# Altium project HW_PROCESSOR_BOARD_R1.PrjPcb (part 1 of 2)
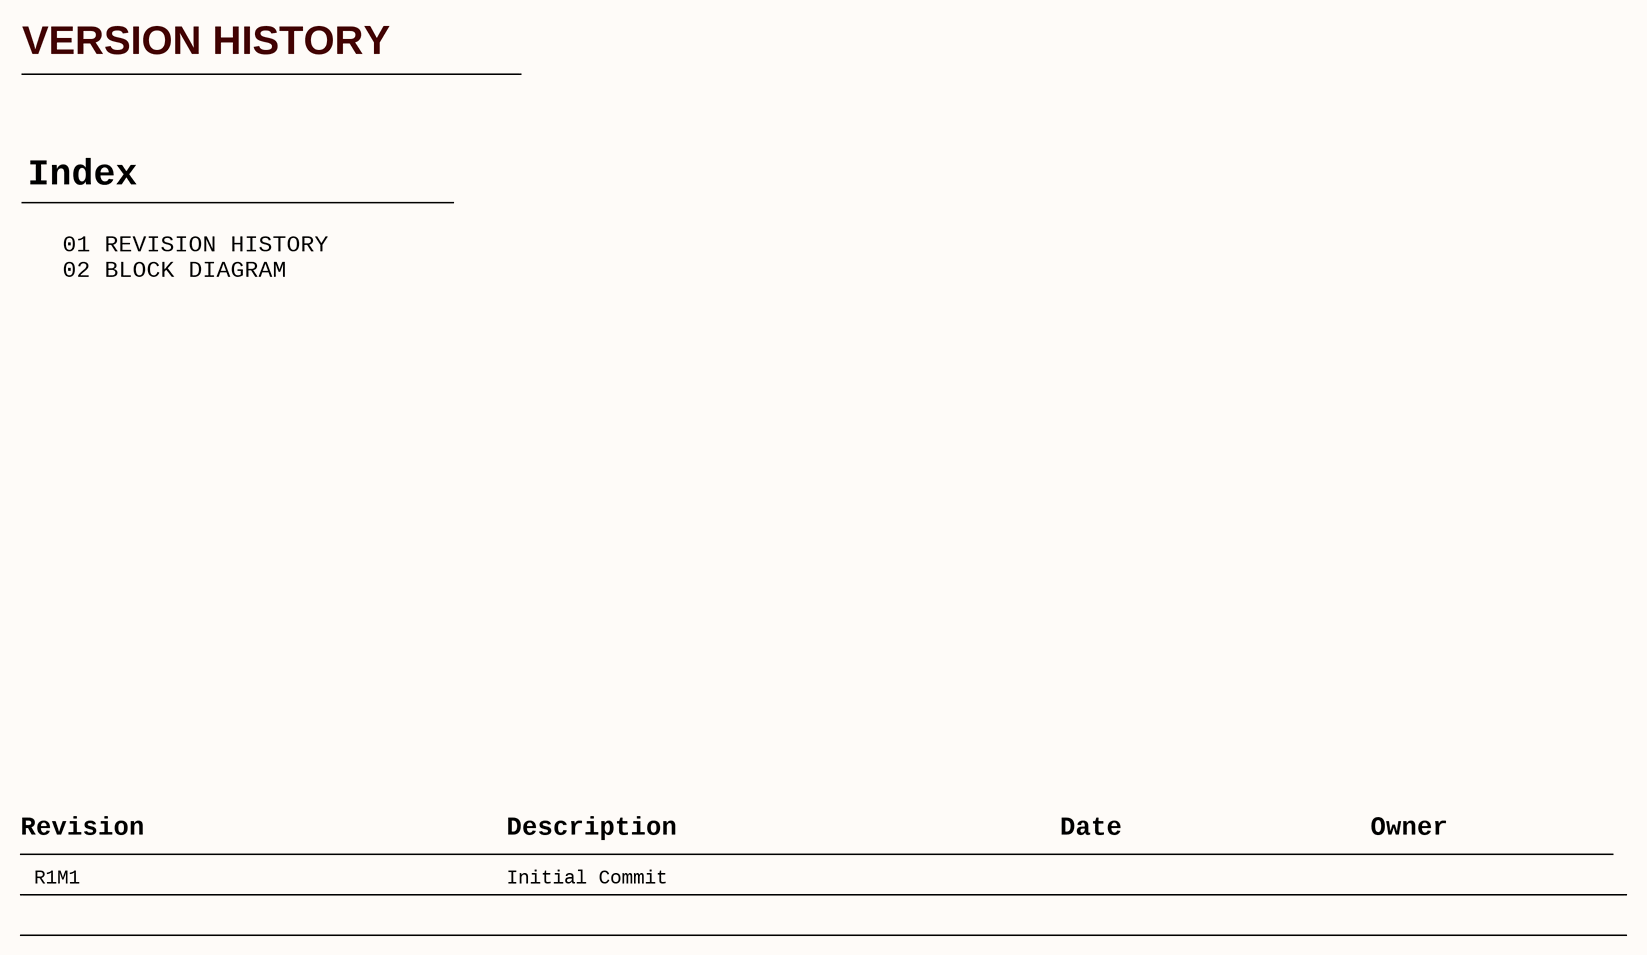
[diagram p0: 01_REVISION_HISTORY.SchDoc]
TitleParameter: HW_PROCESSOR_BOARD; RevisionParameter: R1M1; DrawnByParameter: UKAYACIK
5 sheets, 151 parts. Net scope: global (net labels, ports and power ports of the same name join across sheets).
Board file: HW_PROCESSOR_BOARD_R1.PcbDoc
Sheets:
  01_REVISION_HISTORY.SchDoc
  02_BLOCK_DIAGRAM.SchDoc
  03_CONNECTOR.SchDoc
  04_MCU.SchDoc
  05_BUFFERS.SchDoc

## Sheet 01_REVISION_HISTORY.SchDoc: =TitleParameter
size A3; DrawnBy: UKAYACIK; Organization: ASISGUARD; Address1: Kemalpasa, Kemalpasa Cd. No:290 D:292H, 35060 Bornova/Izmir/Turkey; Revision: R1M1

### Notes on the sheet
- VERSION HISTORY
- Index
- 01 REVISION HISTORY
  02 BLOCK DIAGRAM
- Revision
- R1M1
- Description
- Initial Commit
- Date
- Owner
- Proje/Project:
- Sayfa Adı/Document Name:
- Çizilme Tarihi/Drawing Date
- Umit KAYACIK
- Tasarlayan/Designed By
- Sayfa/Sheet:
- Revision:
- of
- Son Güncelleme/Last Edit Date
- Kontrol eden/Checked By
- Onaylayan/Approved By
- Boyut/Size:
- Varyant/Variant:
- Dil/Language:
- A3
- ENG

## Sheet 02_BLOCK_DIAGRAM.SchDoc: =TitleParameter
size A3; DrawnBy: UKAYACIK; Organization: ASISGUARD; Address1: Kemalpasa, Kemalpasa Cd. No:290 D:292H, 35060 Bornova/Izmir/Turkey; Revision: R1M1
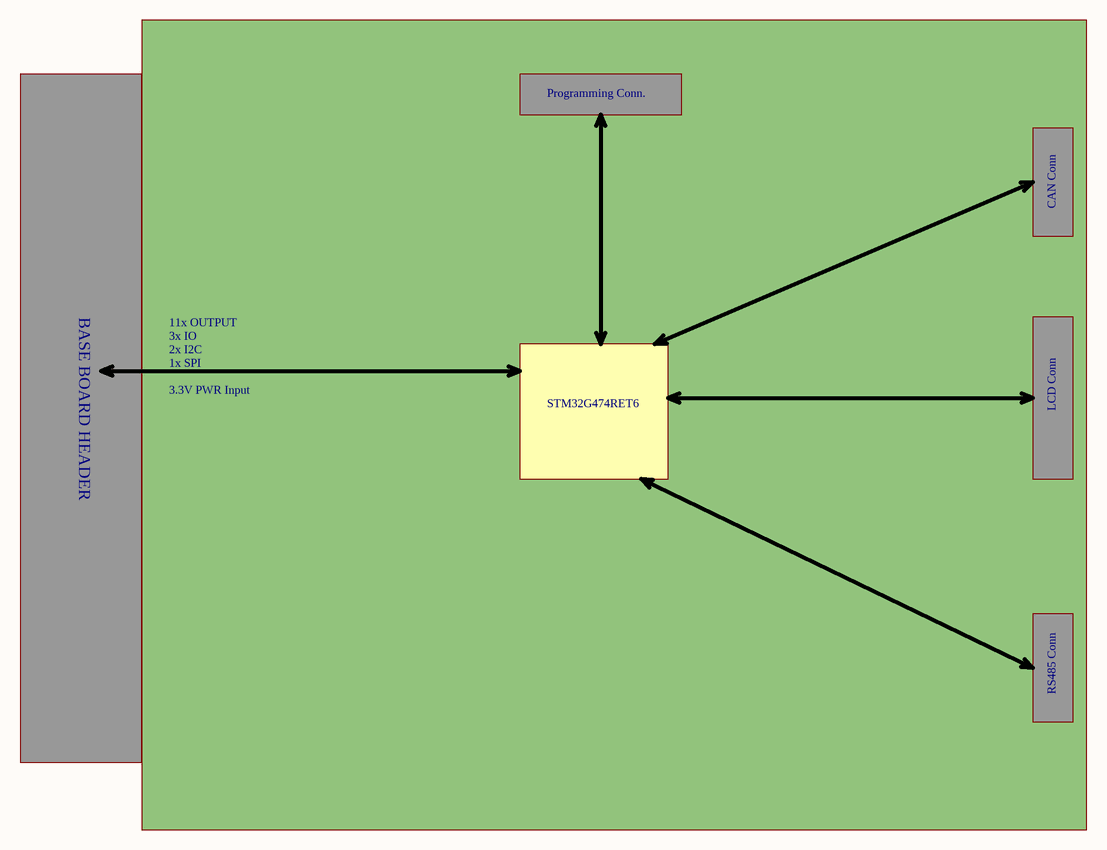
[diagram p1: 02_BLOCK_DIAGRAM.SchDoc]

### Notes on the sheet
- Programming Conn.
- CAN Conn
- BASE BOARD HEADER
- 11x OUTPUT
- 3x IO
- 2x I2C
- 1x SPI
- 3.3V PWR Input
- STM32G474RET6
- LCD Conn
- RS485 Conn
- Proje/Project:
- Sayfa Adı/Document Name:
- Çizilme Tarihi/Drawing Date
- Umit KAYACIK
- Tasarlayan/Designed By
- Sayfa/Sheet:
- Revision:
- of
- Son Güncelleme/Last Edit Date
- Kontrol eden/Checked By
- Onaylayan/Approved By
- Boyut/Size:
- Varyant/Variant:
- Dil/Language:
- A3
- ENG

## Sheet 03_CONNECTOR.SchDoc: =TitleParameter
size A2; SPICEModelCacheRTZHBNFU: <root> / <DocumentId>RTZHBNFU</DocumentId> / </root>; DrawnBy: UKAYACIK; Revision: R1M1
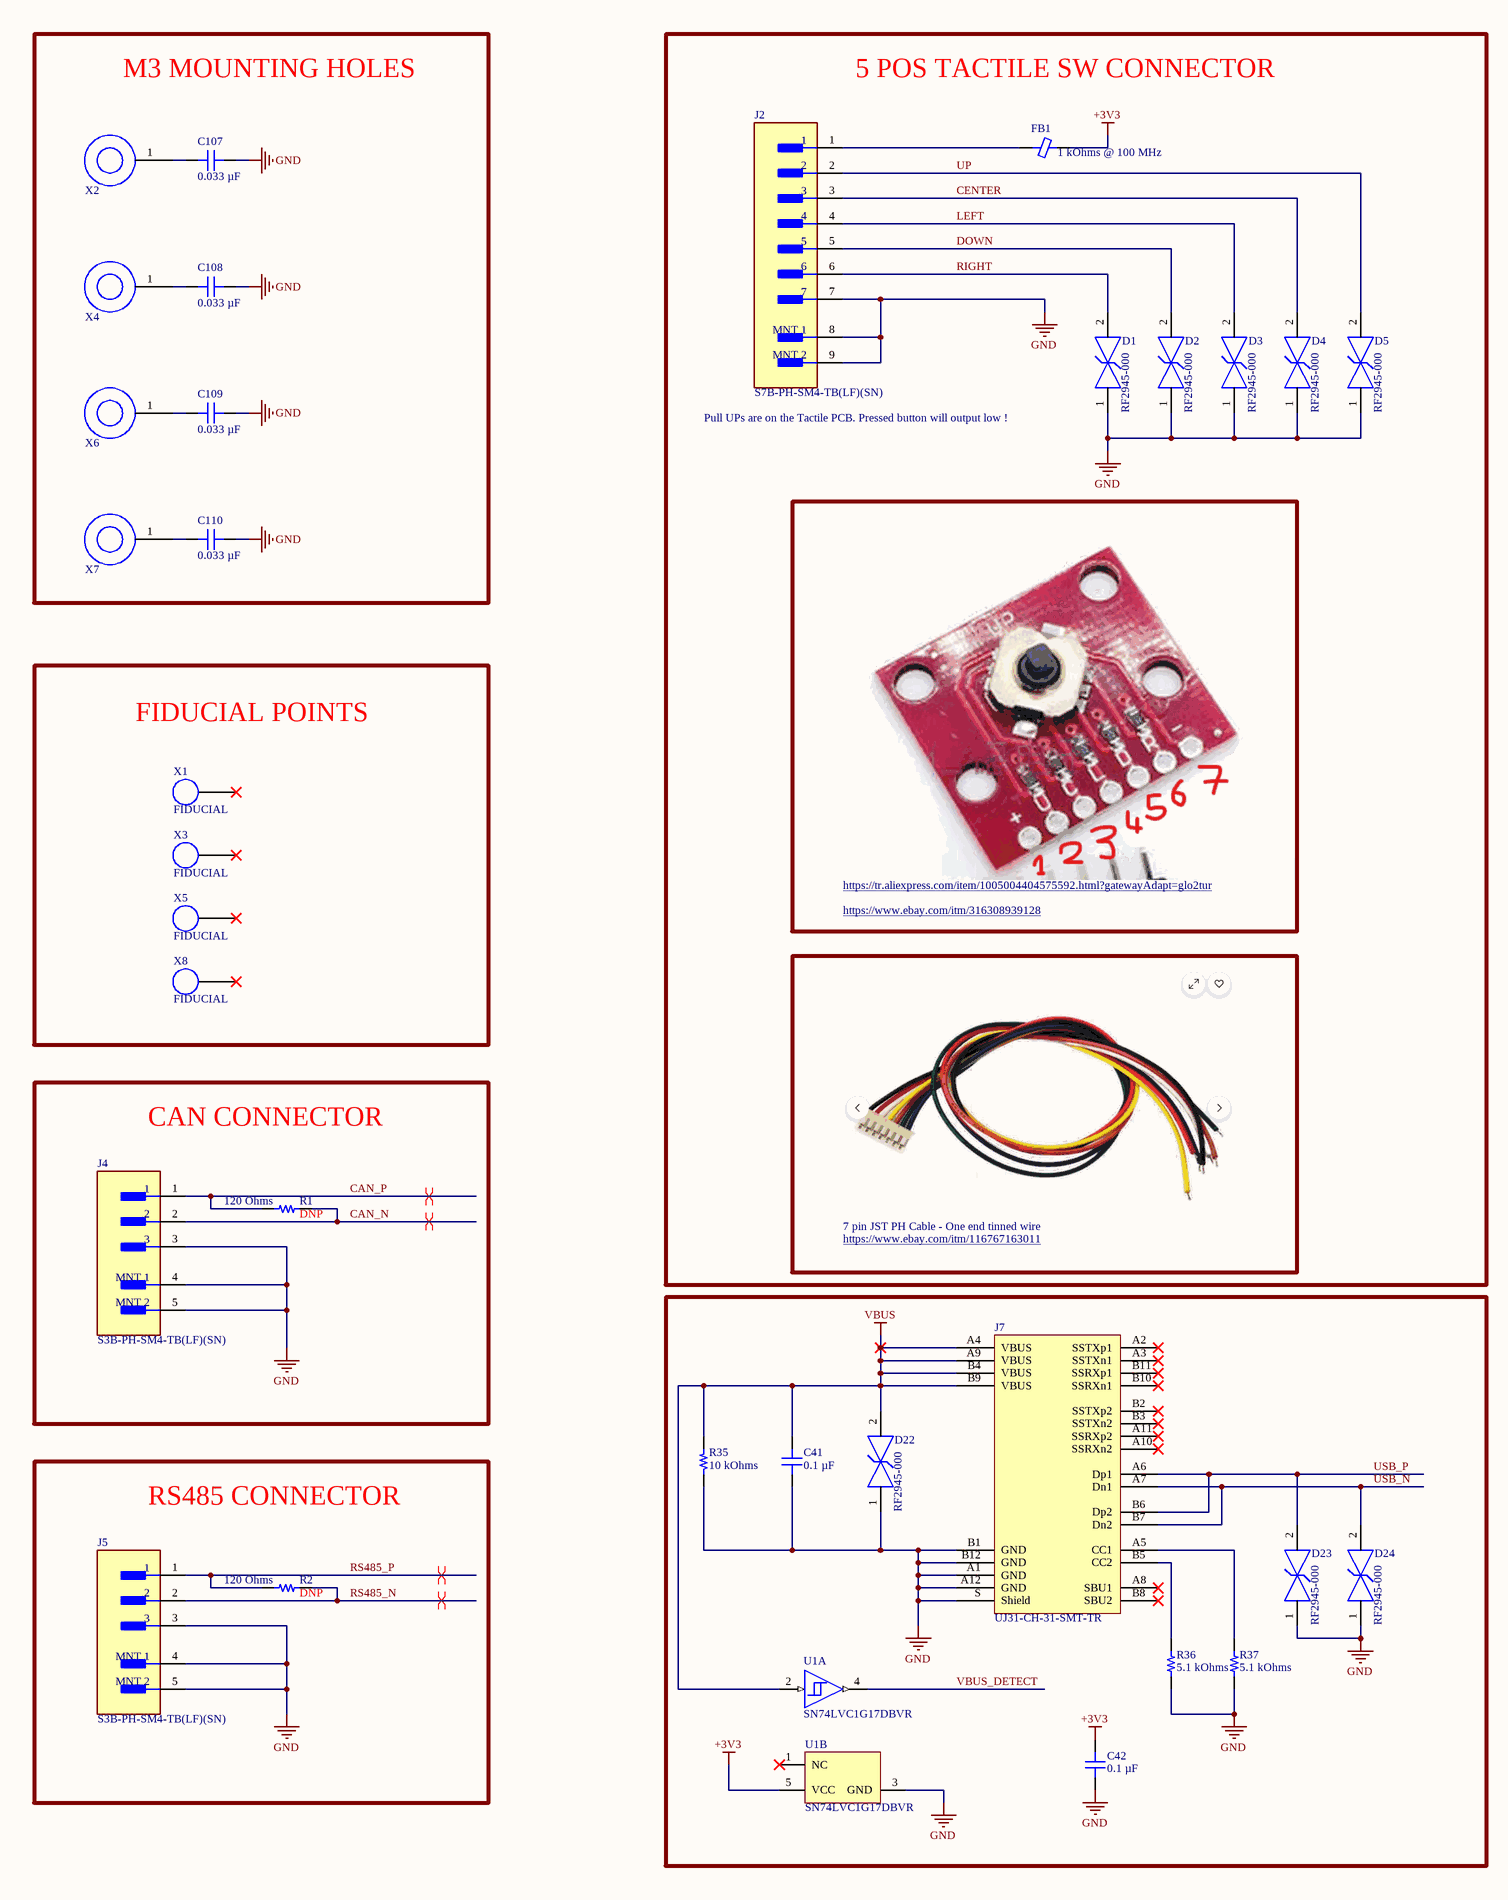
[diagram p2: 03_CONNECTOR.SchDoc, left]
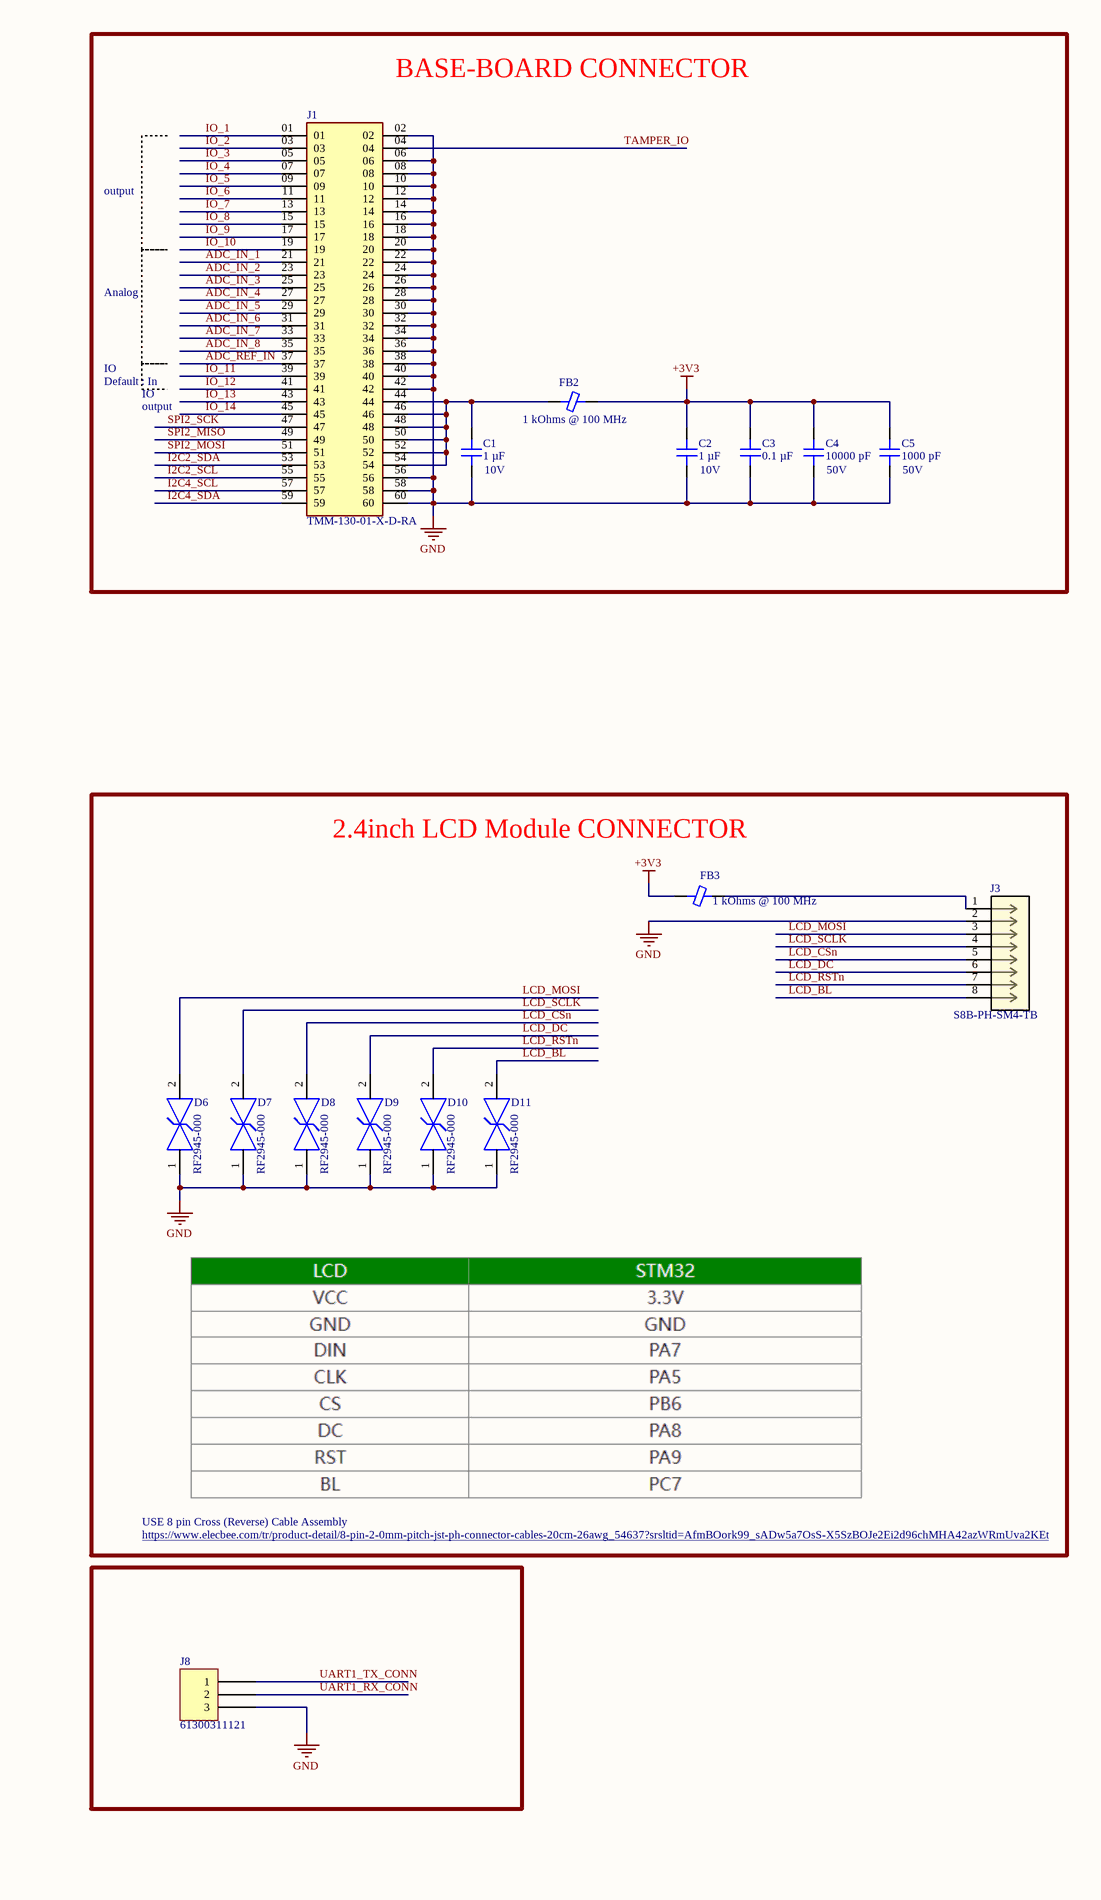
[diagram p3: 03_CONNECTOR.SchDoc, right]

### Parts
C1  Voltage - Rated: 10V  [CAP 0402_1005]  (hidden comment: 1 µF)
C2  Voltage - Rated: 10V  [CAP 0402_1005]  (hidden comment: 1 µF)
C3  0.1 µF  [MURATA GRM155 0402_1005]
C4  Voltage - Rated: 50V  [CAP 0402_1005]  (hidden comment: 10000 pF)
C5  Voltage - Rated: 50V  [CAP 0402_1005]  (hidden comment: 1000 pF)
C41  0.1 µF  [MURATA GRM155 0402_1005]
C42  0.1 µF  [MURATA GRM155 0402_1005]
C107  0.033 µF  [CAP 1210_3225 - 1MM]
C108  0.033 µF  [CAP 1210_3225 - 1MM]
C109  0.033 µF  [CAP 1210_3225 - 1MM]
C110  0.033 µF  [CAP 1210_3225 - 1MM]
D1  RF2945-000  [FP-SESD0402-MFG]
D2  RF2945-000  [FP-SESD0402-MFG]
D3  RF2945-000  [FP-SESD0402-MFG]
D4  RF2945-000  [FP-SESD0402-MFG]
D5  RF2945-000  [FP-SESD0402-MFG]
D6  RF2945-000  [FP-SESD0402-MFG]
D7  RF2945-000  [FP-SESD0402-MFG]
D8  RF2945-000  [FP-SESD0402-MFG]
D9  RF2945-000  [FP-SESD0402-MFG]
D10  RF2945-000  [FP-SESD0402-MFG]
D11  RF2945-000  [FP-SESD0402-MFG]
D22  RF2945-000  [FP-SESD0402-MFG]
D23  RF2945-000  [FP-SESD0402-MFG]
D24  RF2945-000  [FP-SESD0402-MFG]
FB1  1 kOhms @ 100 MHz  [FER 1206_3216]
FB2  1 kOhms @ 100 MHz  [FER 1206_3216]
FB3  1 kOhms @ 100 MHz  [FER 1206_3216]
J1  TMM-130-01-X-D-RA  [SAMTEC_TMM-130-01-X-D-RA]
J2  S7B-PH-SM4-TB(LF)(SN)  [FP-S7B-PH-SM4-TB_LF_SN-MFG]
J3  S8B-PH-SM4-TB  [CONN_S8B-PH-SM4-TB_JST]
J4  S3B-PH-SM4-TB(LF)(SN)  [FP-S3B-PH-SM4-TB_LF_SN-MFG]
J5  S3B-PH-SM4-TB(LF)(SN)  [FP-S3B-PH-SM4-TB_LF_SN-MFG]
J7  UJ31-CH-31-SMT-TR  [CUI UJ31-CH-31-SMT-TR]
J8  61300311121  [WURTH WE-PHD 61300311121]
R1  120 Ohms  [YAGEO RES 0805_2012]
R2  120 Ohms  [YAGEO RES 0805_2012]
R35  10 kOhms  [RES 0402_1005]
R36  5.1 kOhms  [YAGEO RES 0402_1005]
R37  5.1 kOhms  [YAGEO RES 0402_1005]
U1  SN74LVC1G17DBVR  [DBV0005A_L]  (parts A,B of 2)
X1  FIDUCIAL  [FIDUCIAL]  (no BOM)
X2  M3  [FIXING_M3]  (value not drawn)  (no BOM)
X3  FIDUCIAL  [FIDUCIAL]  (no BOM)
X4  M3  [FIXING_M3]  (value not drawn)  (no BOM)
X5  FIDUCIAL  [FIDUCIAL]  (no BOM)
X6  M3  [FIXING_M3]  (value not drawn)  (no BOM)
X7  M3  [FIXING_M3]  (value not drawn)  (no BOM)
X8  FIDUCIAL  [FIDUCIAL]  (no BOM)

### Blocks framed on the sheet
M3 MOUNTING HOLES: C107-C110 X2 X4 X6 X7
5 POS TACTILE SW CONNECTOR: D1-D5 FB1 J2
BASE-BOARD CONNECTOR: C1-C5 FB2 J1
FIDUCIAL POINTS: X1 X3 X5 X8
2.4inch LCD Module CONNECTOR: D6-D11 FB3 J3
CAN CONNECTOR: J4 R1
RS485 CONNECTOR: J5 R2

### Nets
+3V3: C2.2 C3.2 C4.2 C5.2 C42.2 FB1.2 FB2.2 FB3.1 U1.5(VCC)
GND: C1.1 C2.1 C3.1 C4.1 C5.1 C41.1 C42.1 C107.2 C108.2 C109.2 C110.2 D1.1 D2.1 D3.1 D4.1 D5.1 D6.1 D7.1 D8.1 D9.1 D10.1 D11.1 D22.1 D23.1 D24.1 J1.02 J1.06 J1.08 J1.10 J1.12 J1.14 J1.16 J1.18 J1.20 J1.22 J1.24 J1.26 J1.28 J1.30 J1.32 J1.34 J1.36 J1.38 J1.40 J1.42 J1.56 J1.58 J1.60 J2.7 J2.8(MNT_1) J2.9(MNT_2) J3.2 J4.3 J4.4(MNT_1) J4.5(MNT_2) J5.3 J5.4(MNT_1) J5.5(MNT_2) J7.A1(GND) J7.A12(GND) J7.B1(GND) J7.B12(GND) J7.S(Shield) J8.3 R35.2 R36.1 R37.1 U1.3(GND)
VBUS: C41.2 D22.2 J7.A4(VBUS) J7.A9(VBUS) J7.B4(VBUS) J7.B9(VBUS) R35.1 U1.2(A)
ADC_IN_1: J1.21
ADC_IN_2: J1.23
ADC_IN_3: J1.25
ADC_IN_4: J1.27
ADC_IN_5: J1.29
ADC_IN_6: J1.31
ADC_IN_7: J1.33
ADC_IN_8: J1.35
ADC_REF_IN: J1.37
CAN_N: J4.2 R1.2
CAN_P: J4.1 R1.1
CENTER: D4.2 J2.3
DOWN: D2.2 J2.5
I2C2_SCL: J1.55
I2C2_SDA: J1.53
I2C4_SCL: J1.57
I2C4_SDA: J1.59
IO_1: J1.01
IO_2: J1.03
IO_3: J1.05
IO_4: J1.07
IO_5: J1.09
IO_6: J1.11
IO_7: J1.13
IO_8: J1.15
IO_9: J1.17
IO_10: J1.19
IO_11: J1.39
IO_12: J1.41
IO_13: J1.43
IO_14: J1.45
LCD_BL: D11.2 J3.8
LCD_CSn: D8.2 J3.5
LCD_DC: D9.2 J3.6
LCD_MOSI: D6.2 J3.3
LCD_RSTn: D10.2 J3.7
LCD_SCLK: D7.2 J3.4
LEFT: D3.2 J2.4
RIGHT: D1.2 J2.6
RS485_N: J5.2 R2.2
RS485_P: J5.1 R2.1
SPI2_MISO: J1.49
SPI2_MOSI: J1.51
SPI2_SCK: J1.47
TAMPER_IO: J1.04
UART1_RX_CONN: J8.2
UART1_TX_CONN: J8.1
UP: D5.2 J2.2
USB_N: D24.2 J7.A7(Dn1) J7.B7(Dn2)
USB_P: D23.2 J7.A6(Dp1) J7.B6(Dp2)
VBUS_DETECT: U1.4(Y)
NetC1_2: C1.2 FB2.1 J1.44 J1.46 J1.48 J1.50 J1.52 J1.54
NetC107_1: C107.1 X2.1
NetC108_1: C108.1 X4.1
NetC109_1: C109.1 X6.1
NetC110_1: C110.1 X7.1
NetFB1_1: FB1.1 J2.1
NetFB3_2: FB3.2 J3.1
NetJ7_A5: J7.A5(CC1) R37.2
NetJ7_B5: J7.B5(CC2) R36.2

Not connected (* = marked no-connect by the designer): J7 A2(SSTXp1)* A3(SSTXn1)* A8(SBU1)* A10(SSRXn2)* A11(SSRXp2)* B2(SSTXp2)* B3(SSTXn2)* B8(SBU2)* B10(SSRXn1)* B11(SSRXp1)*; U1 1(NC)*; X1 1*; X3 1*; X5 1*; X8 1*

### Layout directives
differential pair: CAN_N, CAN_P, RS485_N, RS485_P

### Notes on the sheet
- output
- Analog
- IO
- Pull UPs are on the Tactile PCB. Pressed button will output low !
- Default : In
- https://tr.aliexpress.com/item/1005004404575592.html?gatewayAdapt=glo2tur
- https://www.ebay.com/itm/316308939128
- (near R1) DNP
- 7 pin JST PH Cable - One end tinned wire
- https://www.ebay.com/itm/116767163011
- USE 8 pin Cross (Reverse) Cable Assembly
- https://www.elecbee.com/tr/product-detail/8-pin-2-0mm-pitch-jst-ph-connector-cables-20cm-26awg_54637?srsltid=AfmBOork99_sADw5a7OsS-X5SzBOJe2Ei2d96chMHA42azWRmUva2KEt
- (near R2) DNP
- Proje/Project:
- Sayfa Adı/Document Name:
- Çizilme Tarihi/Drawing Date
- Son Güncelleme/Last Edit Date
- Umit KAYACIK
- Tasarlayan/Designed By
- Kontrol eden/Checked By
- Boyut/Size:
- Sayfa/Sheet:
- Revision:
- A3
- of
- Onaylayan/Approved By
- Varyant/Variant:
- Dil/Language:
- ENG

### Library data of the parts
C1 C2 = C1005X7S1A105K050BC: CAP CER 1UF 10V X7S 0402; manufacturer: TDK Corporation; Tolerance: ±10%; Part Number: C1005X7S1A105K050BC; Value: 1 µF; Applications: General Purpose; Capacitance: 1 µF; componentlink1description: Datasheet; componentlink1url: https://product.tdk.com/info/en/catalog/datasheets/mlcc_commercial_general_en.pdf?ref_disty=digikey; componentlink2description: DigiKey Link; componentlink2url: https://www.digikey.com/en/products/detail/tdk-corporation/C1005X7S1A105K050BC/3661576; Device Package: 0402 (1005 Metric); Features: Low ESL; lastupdated: 2/9/2024 8:04:17 PM; Lifecycle Status: Active; Minimum Order: 1; Mounting Type: Surface Mount, MLCC; Operating Temperature: -55°C ~ 125°C; Package / Case: 0402 (1005 Metric); packaging: TapeAndReel; partid: 34315; Part Status: Active; price: 0.03; series: C; Size / Dimension: 0.039" L x 0.020" W (1.00mm x 0.50mm); Supplier 1: DigiKey; Supplier Part Number 1: 445-9116-1-ND; Temperature Coefficient: X7S; Thickness (Max): 0.022" (0.55mm)
C3 C41 C42 = GRM155R71H104KE14J: CAP CER 0.1UF 50V X7R 0402; manufacturer: Murata Electronics; Tolerance: ±10%; Part Number: GRM155R71H104KE14J; Capacitance: 0.1 µF; Applications: General Purpose; componentlink1description: Datasheet; componentlink1url: https://search.murata.co.jp/Ceramy/image/img/A01X/G101/ENG/GRM155R71H104KE14-01.pdf; componentlink2description: DigiKey Link; componentlink2url: https://www.digikey.com/en/products/detail/murata-electronics/GRM155R71H104KE14J/4905180; Device Package: 0402 (1005 Metric); lastupdated: 7/23/2025 10:42:35 AM; Lifecycle Status: Active; Minimum Order: 1; Mounting Type: Surface Mount, MLCC; Operating Temperature: -55°C ~ 125°C; Package / Case: 0402 (1005 Metric); packaging: CutTape; partid: 4071; Part Status: Active; price: 0.01; series: GRM; Size / Dimension: 0.039" L x 0.020" W (1.00mm x 0.50mm); Supplier 1: DigiKey; Supplier Part Number 1: 490-13342-1-ND; Temperature Coefficient: X7R; Thickness (Max): 0.022" (0.55mm); value: 0.1 µF; Voltage - Rated: 50V
C4 = CC0402KRX7R9BB103: CAP CER 10000PF 50V X7R 0402; manufacturer: Yageo; Tolerance: ±10%; Part Number: CC0402KRX7R9BB103; Value: 10000 pF; Applications: General Purpose; Capacitance: 10000 pF; componentlink1description: Datasheet; componentlink1url: https://www.yageo.com/upload/media/product/productsearch/datasheet/mlcc/UPY-GPHC_X7R_6.3V-to-50V_18.pdf; componentlink2description: DigiKey Link; componentlink2url: https://www.digikey.com/en/products/detail/yageo/CC0402KRX7R9BB103/2103087; Device Package: 0402 (1005 Metric); lastupdated: 2/9/2024 8:04:30 PM; Lifecycle Status: Active; Minimum Order: 10; Mounting Type: Surface Mount, MLCC; Operating Temperature: -55°C ~ 125°C; Package / Case: 0402 (1005 Metric); packaging: CutTape; partid: 6681; Part Status: Active; price: 0.01; series: CC; Size / Dimension: 0.039" L x 0.020" W (1.00mm x 0.50mm); Supplier 1: DigiKey; Supplier Part Number 1: 311-1349-1-ND; Temperature Coefficient: X7R; Thickness (Max): 0.022" (0.55mm)
C5 = CC0402KRX7R9BB102: CAP CER 1000PF 50V X7R 0402; manufacturer: Yageo; Tolerance: ±10%; Part Number: CC0402KRX7R9BB102; Value: 1000 pF; Applications: General Purpose; Capacitance: 1000 pF; componentlink1description: Datasheet; componentlink1url: https://www.yageo.com/upload/media/product/productsearch/datasheet/mlcc/UPY-GPHC_X7R_6.3V-to-50V_18.pdf; componentlink2description: DigiKey Link; componentlink2url: https://www.digikey.com/en/products/detail/yageo/CC0402KRX7R9BB102/302770; Device Package: 0402 (1005 Metric); lastupdated: 2/9/2024 8:04:33 PM; Lifecycle Status: Active; Minimum Order: 10; Mounting Type: Surface Mount, MLCC; Operating Temperature: -55°C ~ 125°C; Package / Case: 0402 (1005 Metric); packaging: CutTape; partid: 4791; Part Status: Active; price: 0.01; series: CC; Size / Dimension: 0.039" L x 0.020" W (1.00mm x 0.50mm); Supplier 1: DigiKey; Supplier Part Number 1: 311-1036-1-ND; Temperature Coefficient: X7R; Thickness (Max): 0.022" (0.55mm)
C107-C110 = C1210X333KDRAC7800: CAP CER 0.033UF 1KV X7R 1210; manufacturer: KEMET; Tolerance: ±10%; Voltage - Rated: 1000V (1kV); Part Number: C1210X333KDRAC7800; Value: 0.033 µF; Applications: Boardflex Sensitive; Capacitance: 0.033 µF; componentlink1description: Datasheet; componentlink1url: https://api.kemet.com/component-edge/download/datasheet/C1210X333KDRACTU.pdf; componentlink2description: DigiKey Link; componentlink2url: https://www.digikey.com/en/products/detail/kemet/C1210X333KDRAC7800/3084039; Device Package: 1210 (3225 Metric); Features: Low ESL, Soft Termination, High Voltage; lastupdated: 04/06/2024 19:20:53; Lifecycle Status: Active; Minimum Order: 1; Mounting Type: Surface Mount, MLCC; Operating Temperature: -55°C ~ 125°C; Package / Case: 1210 (3225 Metric); packaging: TapeAndReel; partid: 29427; Part Status: Active; price: 0.17; series: SMD Comm X7R HV Flex; Size / Dimension: 0.130" L x 0.102" W (3.30mm x 2.60mm); Supplier 1: DigiKey; Supplier Part Number 1: 399-C1210X333KDRAC7800CT-ND; Temperature Coefficient: X7R; Thickness (Max): 0.067" (1.70mm)
D1-D11 D22-D24 = CMP-08607-000062-1: TVS DIODE 7V 10V 0402; Manufacturer: Littelfuse; Value: 0.1pF; Breakdown Voltage: 9.8V; Number Of Channels: 1; Peak Pulse Current: 2A; Direction: Bidirectional; Automotive Grade: Grade 1; Standoff Height: 0mm; Octopart: https://octopart.com/rf2945-000-littelfuse-56516902; Device Class L3: unset; ComponentLink2Description: Datasheet; Lead Free: Yes; Temperature Range Low: -55°C; Clamping Voltage: 10V; Digikey Description: TVS DIODE 7V 10V 0402; Category: Diode; Temperature: -55°C to +125°C; Device Class L1: Circuit Protection; Capacitance: 0.1pF; RoHS: TRUE; Device Class L2: TVS Diodes; Package: SESD0402; Reverse Standoff Voltage: 7V; Automotive: Yes; Height: 0.43mm; Manufacturer Part Number: RF2945-000; Temperature Range High: +125°C; ComponentLink2URL: https://www.littelfuse.com/~/media/electronics/datasheets/tvs_diode_arrays/littelfuse_tvs_diode_array_sesd_ultra_low_capacitance_discrete_tvs_datasheet.pdf.pdf
FB1-FB3 = BLM31KN102SN1L: FERRITE BEAD 1K OHM 1206 1LN; Manufacturer: Murata Electronics; Current Rating (Max): 2A; DC Resistance (DCR) (Max): 75mOhm; Filter Type: Power Line; Number of Lines: 1; Part Number: BLM31KN102SN1L; ComponentLink1Description: Datasheet; ComponentLink1URL: https://www.murata.com/en-global/products/productdata/8796739698718/ENFA0006.pdf; ComponentLink2Description: DigiKey Link; ComponentLink2URL: https://www.digikey.com/en/products/detail/murata-electronics/BLM31KN102SN1L/7564086; Device Package: 1206 (3216 Metric); Height (Max): 0.071" (1.80mm); Impedance @ Frequency: 1 kOhms @ 100 MHz; LastUpdated: 6/3/2024 7:52:37 PM; Lifecycle Status: Active; Minimum Order: 1; Mounting Type: Surface Mount; Operating Temperature: -55°C ~ 125°C; Package / Case: 1206 (3216 Metric); Packaging: TapeAndReel; PartId: 1659; Part Status: Active; Price: 0.10; Series: BLM; Size / Dimension: 0.126" L x 0.063" W (3.20mm x 1.60mm); Supplier 1: DigiKey; Supplier Part Number 1: 490-16521-1-ND; Value: 1 kOhms @ 100 MHz
J1 = TMM-130-01-X-D-RA: Connector Header Through Hole, Right Angle 60 position 0.079 (2.00mm); MF: Samtec; MP: TMM-130-01-L-D-RA; SnapEDA_Link: https://www.snapeda.com/parts/TMM-130-01-L-D-RA/Samtec/view-part/?ref=snap; Package: None; Value: *; Check_prices: https://www.snapeda.com/parts/TMM-130-01-L-D-RA/Samtec/view-part/?ref=eda
J2 = CMP-17439-000040-1: CONN HEADER SMD R/A 7POS 2MM; Connector Type: Male Pin; Working Voltage: 100V; Gender: Male; Current Rating: 2A; Number of Positions: 7; Contact Resistance: 20mR; Insulation Resistance: 1GR; Housing Color: Beige; Height: 9.4mm; Fastening Type: Detent; Color: Natural; Contact Plating: Tin; Max Current Rating: 2A; Pitch: 2mm; Voltage Rating (AC): 100V; REACH SVHC: No SVHC; Min Operating Temperature: -25°C; Number of Rows: 1; Width: 5mm; Voltage Rating: 100V; Max Voltage Rating (AC): 100V; Number of Contacts: 7; Lead Pitch: 2mm; Max Operating Temperature: 85°C; Contact Mating Length: 0.13inch; Contact Type: Male Pin; Orientation: Right Angle; Depth: 7.6mm; Contact Material: Copper Alloy; Lead Free: Lead Free; Mount: Surface Mount; Length: 17.9mm; Flammability Rating: UL94 V-0; Series: PH; Packaging: Tape and Reel; Number of Poles: 7; Termination: Solder; Housing Material: Polyamide
J3 = S8B-PH-SM4-TB: Description; Manufacturer_Name: JST; Copyright: Copyright (C) 2025 Ultra Librarian. All rights reserved.; Manufacturer_Part_Number: S8B-PH-SM4-TB; RefDes: RefDes; Type: Type; Supplier 1: Arrow Electronics; Supplier Part Number 1: S8B-PH-SM4-TB(LF)(SN)
J4 J5 = CMP-2000-07023-2: CONN HEADER SMD R/A 3POS 2MM; Voltage Rating: 100V; Gender: Male; Max Current Rating: 2A; Number of Contacts: 3; Insulation Resistance: 1GR; Contact Resistance: 10mR; Termination: Solder; Orientation: Right Angle; Insulation Color: Natural; Flammability Rating: UL94 V-0; Width: 5mm; Lead Free: Lead Free; Mount: Surface Mount; Max Operating Temperature: 85°C; Connector Type: Header; Fastening Type: Detent; Max Voltage Rating (DC): 100V; Housing Material: Polyamide; Number of Rows: 1; Housing Color: Beige; Contact Plating: Tin; Contact Shape: Square; Working Voltage: 100V; Contact Material: Copper Alloy; Contact Mating Length: 0.13inch; Contact Type: Male Pin; Max Voltage Rating (AC): 100V; Packaging: Tape and Reel; Min Operating Temperature: -25°C; Number of Positions: 3; REACH SVHC: No SVHC; Contact Finish - Mating: TIN; Color: Natural; Length: 9.9mm; Insulation Material: Nylon; Depth: 7.6mm; Current Rating: 2A; Material: Polyamide; Voltage Rating (AC): 100V; Pitch: 2mm; Series: PH; Height: 9.4mm; Number of Poles: 3; Lead Pitch: 2mm
J7 = UJ31-CH-31-SMT-TR: CONN RCPT USB3.1 TYPEC 24POS R/A; Manufacturer: CUI Devices; Connector Type: USB - C (Type - C); Current Rating (Amps): 0.25A, 1.25A, 5A, 6.25A; Gender: Receptacle; Mating Cycles: 10000; Number of Contacts: 24; Number of Ports: 1; Shielding: Shielded; Specifications: USB 3.1 (USB 3.1 Gen 2, Superspeed+); Voltage - Rated: 20V; Part Number: UJ31-CH-31-SMT-TR; ComponentLink1Description: Datasheet; ComponentLink1URL: https://www.cuidevices.com/product/resource/digikeypdf/uj31-ch-smt.pdf; ComponentLink2Description: DigiKey Link; ComponentLink2URL: http://digikey.com/product-detail/en/cui-devices/UJ31-CH-31-SMT-TR/102-4485-1-ND/8024065; Features: Board Guide; LastUpdated: 5/24/2020 10:49:54 PM; Lifecycle Status: Active; Minimum Order: 1; Mounting Feature: Horizontal; Mounting Type: Surface Mount, Right Angle; Through Hole; Operating Temperature: -30°C ~ 85°C; Packaging: TapeAndReel; Part Status: Active; Price: 0.89; Series: UJ31; Supplier 1: DigiKey; Supplier Part Number 1: 102-4485-1-ND; Termination: Solder
J8 = 61300311121: CONN HEADER VERT 3POS 2.54MM; Manufacturer: Würth Elektronik; Contact Length - Mating: 0.236" (6.00mm); Contact Length - Post: 0.118" (3.00mm); Current Rating (Amps): 3A; Material Flammability Rating: UL94 V-0; Number of Positions: 3; Number of Positions Loaded: All; Overall Contact Length: 0.454" (11.54mm); Pitch - Mating: 0.100" (2.54mm); Row Spacing - Mating: -40°C ~ 105°C; Shrouding: Unshrouded; Style: Board to Board or Cable; Part Number: 61300311121; ComponentLink1Description: Datasheet; ComponentLink1URL: https://katalog.we-online.de/em/datasheet/6130xx11121.pdf; ComponentLink2Description: DigiKey Link; ComponentLink2URL: https://www.digikey.com/en/products/detail/würth-elektronik/61300311121/4846825; Connector Type: Header; Contact Finish - Mating: Gold; Contact Material: Copper Alloy; Contact Shape: Square; Contact Type: Male Pin; Fastening Type: Push-Pull; Insulation Color: Black; Insulation Height: 0.100" (2.54mm); Insulation Material: Polyamide (PA6T), Nylon 6T; LastUpdated: 10/18/2024 1:43:15 PM; Lifecycle Status: Active; Minimum Order: 1; Mounting Type: Through Hole; Number of Rows: 1; Operating Temperature: -40°C ~ 105°C; Packaging: Bulk; PartId: 189; Part Status: Active; Price: 0.07; Series: WR-PHD; Supplier 1: DigiKey; Supplier Part Number 1: 732-5316-ND; Termination: Solder
R1 R2 = RC0805FR-07120RL: RES 120 OHM 1% 1/8W 0805; Manufacturer: Yageo; Power (Watts): 0.125W, 1/8W; Temperature Coefficient: ±100ppm/°C; Part Number: RC0805FR-07120RL; Value: 120 Ohms; ComponentLink1Description: Datasheet; ComponentLink1URL: https://www.yageo.com/upload/media/product/productsearch/datasheet/rchip/PYu-RC_Group_51_RoHS_L_10.pdf; ComponentLink2Description: DigiKey Link; ComponentLink2URL: https://www.digikey.com/en/products/detail/yageo/RC0805FR-07120RL/727575; Composition: Thick Film; Device Package: 0805 (2012 Metric); Features: Moisture Resistant; Height - Seated (Max): 0.024" (0.60mm); LastUpdated: 7/25/2024 9:20:22 AM; Lifecycle Status: Active; Minimum Order: 1; Number of Terminations: 2; Operating Temperature: -55°C ~ 155°C; Package / Case: 0805 (2012 Metric); Packaging: TapeAndReel; PartId: 39440; Part Status: Active; Price: 0.01; Resistance: 120 Ohms; Series: RC_L; Size / Dimension: 0.079" L x 0.049" W (2.00mm x 1.25mm); Supplier 1: DigiKey; Supplier Part Number 1: 311-120CRCT-ND; Supplier Device Package: 0805; Tolerance: ±1%
R35 = RC0402FR-0710KL: RES 10K OHM 1% 1/16W 0402; Manufacturer: Yageo; Power (Watts): 0.063W, 1/16W; Temperature Coefficient: ±100ppm/°C; Part Number: RC0402FR-0710KL; Value: 10 kOhms; ComponentLink1Description: Datasheet; ComponentLink1URL: https://www.yageo.com/upload/media/product/productsearch/datasheet/rchip/PYu-RC_Group_51_RoHS_L_10.pdf; ComponentLink2Description: DigiKey Link; ComponentLink2URL: https://www.digikey.com/en/products/detail/yageo/RC0402FR-0710KL/726523; Composition: Thick Film; Device Package: 0402 (1005 Metric); Features: Moisture Resistant; Height - Seated (Max): 0.016" (0.40mm); LastUpdated: 30.04.2023 19:24:29; Lifecycle Status: Active; Minimum Order: 1; Number of Terminations: 2; Operating Temperature: -55°C ~ 155°C; Package / Case: 0402 (1005 Metric); Packaging: CutTape; PartId: 17593; Part Status: Active; Price: 0.01; Resistance: 10 kOhms; Series: RC_L; Size / Dimension: 0.039" L x 0.020" W (1.00mm x 0.50mm); Supplier 1: DigiKey; Supplier Part Number 1: 311-10.0KLRCT-ND; Supplier Device Package: 0402; Tolerance: ±1%
R36 R37 = RC0402FR-075K1L: RES 5.1K OHM 1% 1/16W 0402; Manufacturer: Yageo; Power (Watts): 0.063W, 1/16W; Temperature Coefficient: ±100ppm/°C; Part Number: RC0402FR-075K1L; Value: 5.1 kOhms; ComponentLink1Description: Datasheet; ComponentLink1URL: https://www.yageo.com/upload/media/product/productsearch/datasheet/rchip/PYu-RC_Group_51_RoHS_L_10.pdf; ComponentLink2Description: DigiKey Link; ComponentLink2URL: https://www.digikey.com/en/products/detail/yageo/RC0402FR-075K1L/726624; Composition: Thick Film; Device Package: 0402 (1005 Metric); Features: Moisture Resistant; Height - Seated (Max): 0.016" (0.40mm); LastUpdated: 8/31/2025 3:04:04 PM; Lifecycle Status: Active; Minimum Order: 1; Number of Terminations: 2; Operating Temperature: -55°C ~ 155°C; Package / Case: 0402 (1005 Metric); Packaging: CutTape; PartId: 17937; Part Status: Active; Price: 0.01; Resistance: 5.1 kOhms; Series: RC_L; Size / Dimension: 0.039" L x 0.020" W (1.00mm x 0.50mm); Supplier 1: DigiKey; Supplier Part Number 1: 311-5.10KLRCT-ND; Supplier Device Package: 0402; Tolerance: ±1%
U1 = CMP-0859-00033-4: Single Schmitt-Trigger Buffer, DBV0005A, LARGE T&R; Manufacturer: Texas Instruments; Output Drive (IOL/IOH)(Max)(mA): 32/-32; Technology Family: LVC; ICC @ Nom Voltage(Max)(mA): 0.01; VCC(Min)(V): 1.65; F @ Nom Voltage(Max)(Mhz): 150; Schmitt Trigger: Yes; Voltage(Nom)(V): 1.8,2.5,3.3,5; 3-State Output: No; Bits(#): 1; VCC(Max)(V): 5.5; Input Type: CMOS/TTL; Logic: True; tpd @ Nom Voltage(Max)(ns): 11,6.5,5.5,5; Output Type: CMOS; Rating: Catalog; Sub-Family: Non-Inverting Buffer/Driver; PackageReference: DBV0005A; DatasheetVersion: SCES351V; Generic Part Number: SN74LVC1G17; Operating Temperature Range(C): -40 to 125,-40 to 85
X1 X3 X5 X8 = FIDUCIAL: FIDUCIAL 1mm
X2 X4 X6 X7 = FIXING_M3: FIXING HOLE M3; Value: M3

## Sheet 04_MCU.SchDoc: =TitleParameter
size A3; DrawnBy: UKAYACIK; Organization: ASISGUARD; Address1: Kemalpasa, Kemalpasa Cd. No:290 D:292H, 35060 Bornova/Izmir/Turkey; Revision: R1M1
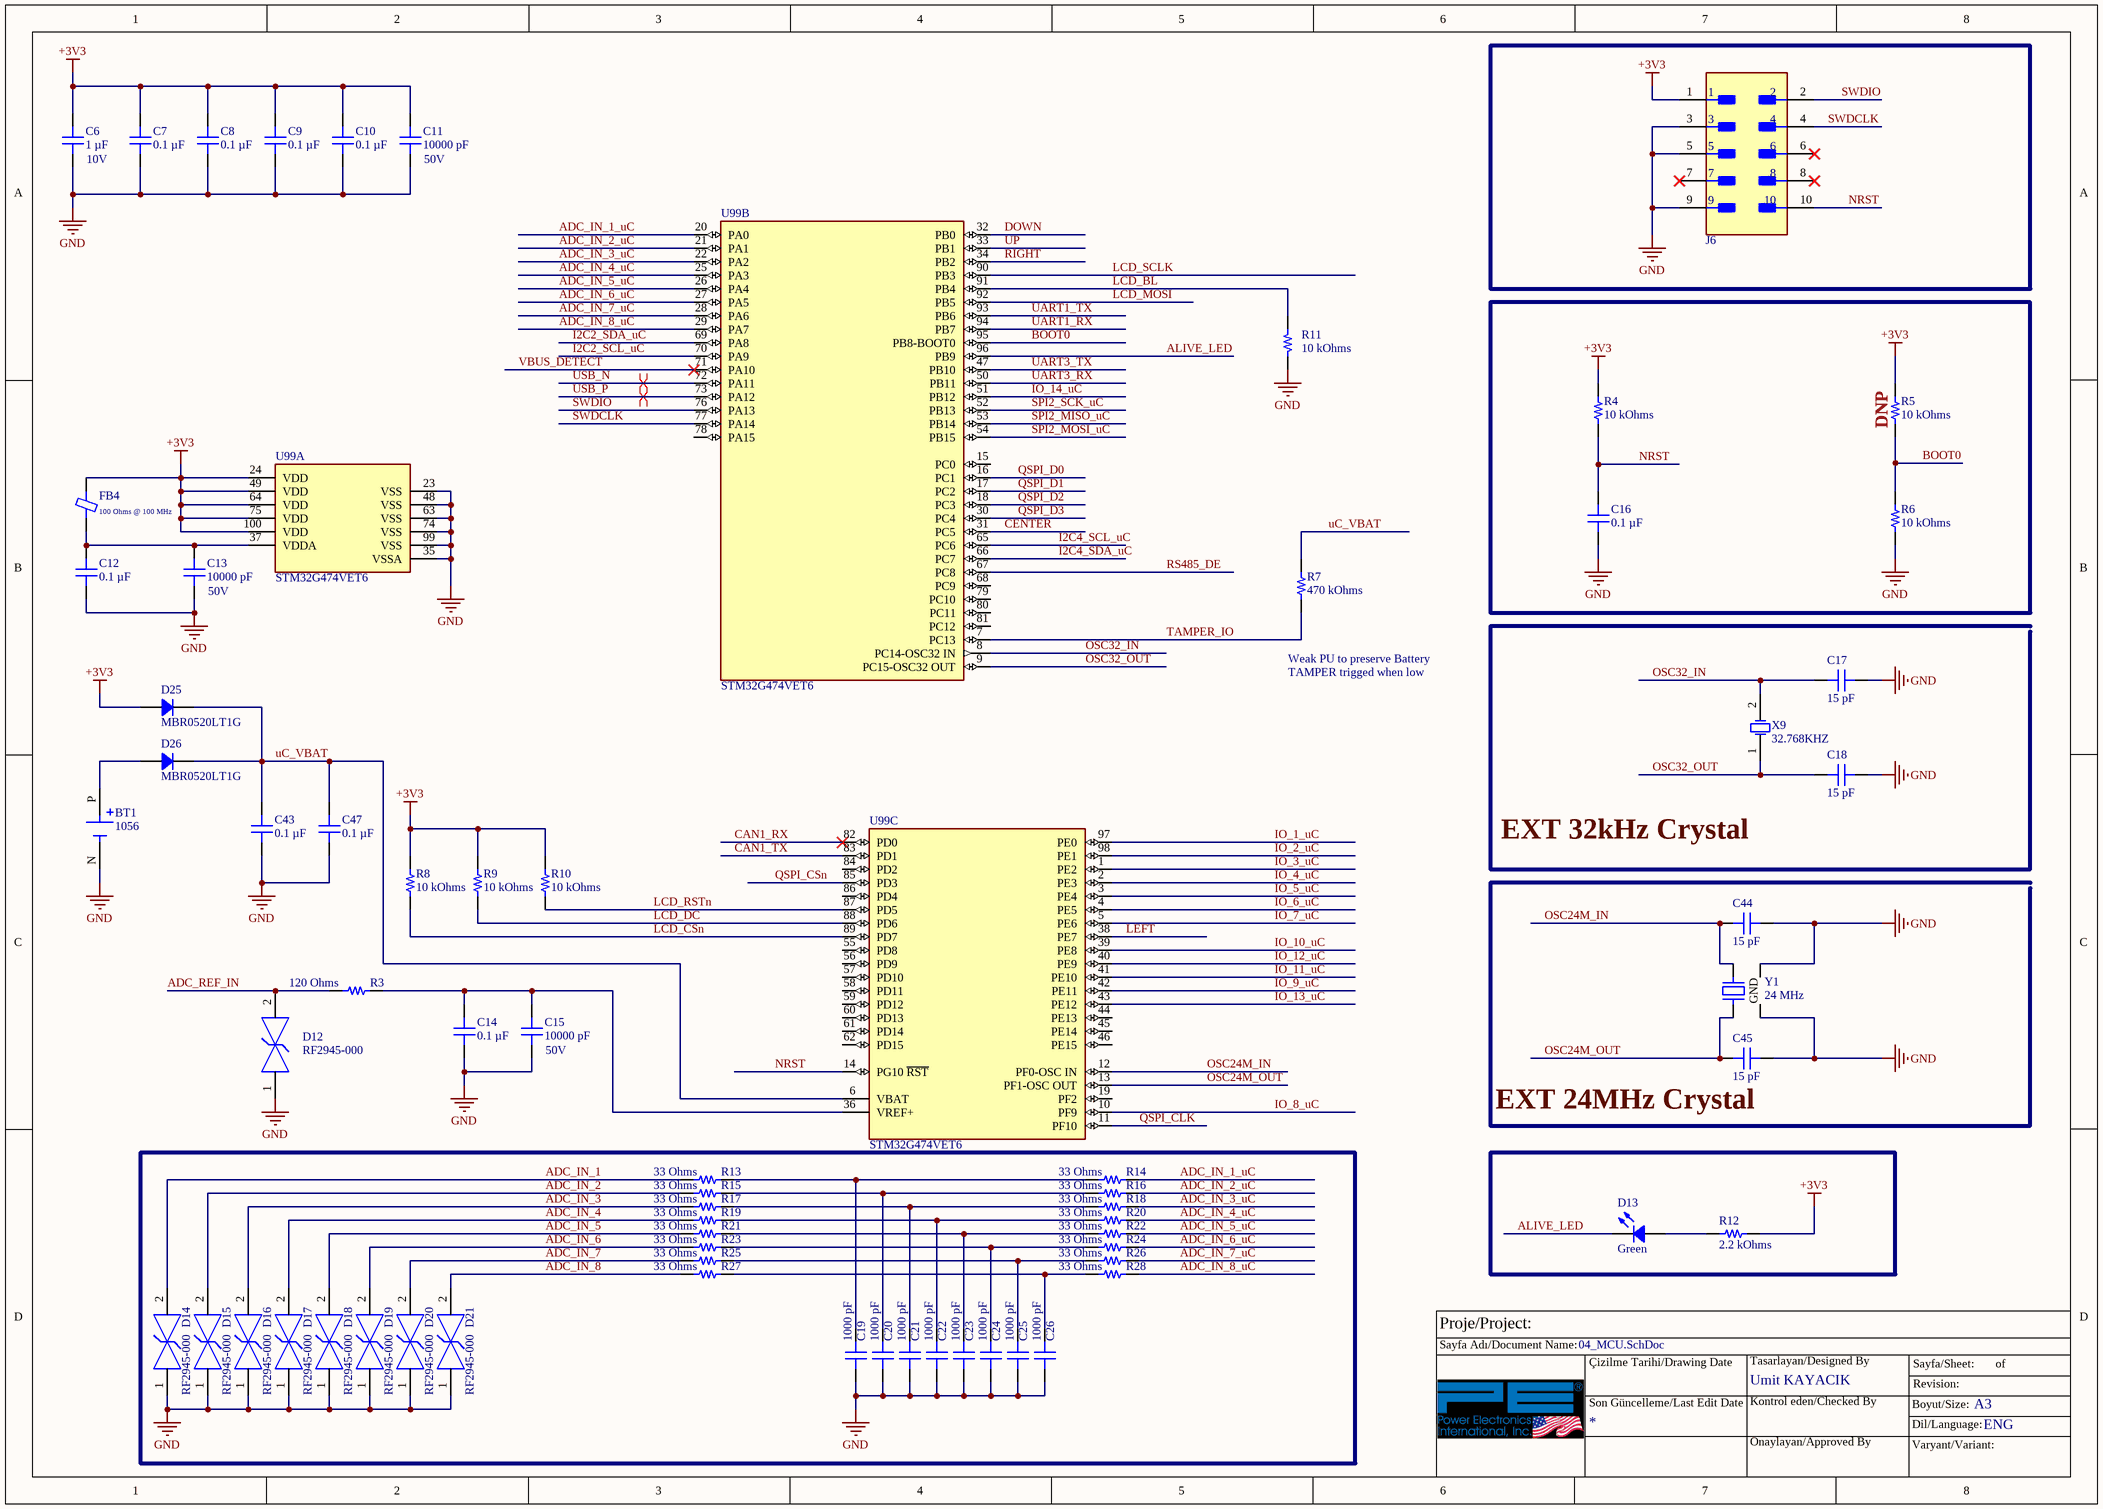
[diagram p4: 04_MCU.SchDoc]

### Parts
BT1  1056  [BAT_1056]
C6  Voltage - Rated: 10V  [CAP 0402_1005]  (hidden comment: 1 µF)
C7  0.1 µF  [MURATA GRM155 0402_1005]
C8  0.1 µF  [MURATA GRM155 0402_1005]
C9  0.1 µF  [MURATA GRM155 0402_1005]
C10  0.1 µF  [MURATA GRM155 0402_1005]
C11  Voltage - Rated: 50V  [CAP 0402_1005]  (hidden comment: 10000 pF)
C12  0.1 µF  [MURATA GRM155 0402_1005]
C13  Voltage - Rated: 50V  [CAP 0402_1005]  (hidden comment: 10000 pF)
C14  0.1 µF  [MURATA GRM155 0402_1005]
C15  Voltage - Rated: 50V  [CAP 0402_1005]  (hidden comment: 10000 pF)
C16  0.1 µF  [MURATA GRM155 0402_1005]
C17  15 pF  [CAP 0402_1005]
C18  15 pF  [CAP 0402_1005]
C19  1000 pF  [CAP 0402_1005]
C20  1000 pF  [CAP 0402_1005]
C21  1000 pF  [CAP 0402_1005]
C22  1000 pF  [CAP 0402_1005]
C23  1000 pF  [CAP 0402_1005]
C24  1000 pF  [CAP 0402_1005]
C25  1000 pF  [CAP 0402_1005]
C26  1000 pF  [CAP 0402_1005]
C43  0.1 µF  [MURATA GRM155 0402_1005]
C44  15 pF  [CAP 0402_1005]
C45  15 pF  [CAP 0402_1005]
C47  0.1 µF  [MURATA GRM155 0402_1005]
D12  RF2945-000  [FP-SESD0402-MFG]
D13  Green  [LED 0603_1608 GREEN]
D14  RF2945-000  [FP-SESD0402-MFG]
D15  RF2945-000  [FP-SESD0402-MFG]
D16  RF2945-000  [FP-SESD0402-MFG]
D17  RF2945-000  [FP-SESD0402-MFG]
D18  RF2945-000  [FP-SESD0402-MFG]
D19  RF2945-000  [FP-SESD0402-MFG]
D20  RF2945-000  [FP-SESD0402-MFG]
D21  RF2945-000  [FP-SESD0402-MFG]
D25  MBR0520LT1G  [SOD-123]
D26  MBR0520LT1G  [SOD-123]
FB4  100 Ohms @ 100 MHz  [FER 0603_1608]
J6  FTSH-105-01-F-DV-K-P-TR  [Samtec_0_MFG]  (value not drawn)
R3  120 Ohms  [YAGEO RES 0805_2012]
R4  10 kOhms  [RES 0402_1005]
R5  10 kOhms  [RES 0402_1005]
R6  10 kOhms  [RES 0402_1005]
R7  470 kOhms  [YAGEO RES 0402_1005]
R8  10 kOhms  [RES 0402_1005]
R9  10 kOhms  [RES 0402_1005]
R10  10 kOhms  [RES 0402_1005]
R11  10 kOhms  [RES 0402_1005]
R12  2.2 kOhms  [RES 0402_1005]
R13  33 Ohms  [YAGEO RES 0402_1005]
R14  33 Ohms  [YAGEO RES 0402_1005]
R15  33 Ohms  [YAGEO RES 0402_1005]
R16  33 Ohms  [YAGEO RES 0402_1005]
R17  33 Ohms  [YAGEO RES 0402_1005]
R18  33 Ohms  [YAGEO RES 0402_1005]
R19  33 Ohms  [YAGEO RES 0402_1005]
R20  33 Ohms  [YAGEO RES 0402_1005]
R21  33 Ohms  [YAGEO RES 0402_1005]
R22  33 Ohms  [YAGEO RES 0402_1005]
R23  33 Ohms  [YAGEO RES 0402_1005]
R24  33 Ohms  [YAGEO RES 0402_1005]
R25  33 Ohms  [YAGEO RES 0402_1005]
R26  33 Ohms  [YAGEO RES 0402_1005]
R27  33 Ohms  [YAGEO RES 0402_1005]
R28  33 Ohms  [YAGEO RES 0402_1005]
U99  STM32G474VET6  [FP-LQFP100-1L-IPC_B]  (parts A,B,C of 3)
X9  value 32.768KHZ  [CRY_ABS07]  (hidden comment: CRYSTAL 32.7680KHZ 12.5PF SMD)
Y1  24 MHz  [EPSON TSX-3225]

### Blocks framed on the sheet
DNP: C16 R4-R6

### Nets
+3V3: C6.2 C7.2 C8.2 C9.2 C10.2 C11.2 D25.1 FB4.2 J6.1 R4.1 R5.1 R8.1 R9.1 R10.1 R12.2 U99.24(VDD) U99.49(VDD) U99.64(VDD) U99.75(VDD) U99.100(VDD)
GND: BT1.N(NEG) C6.1 C7.1 C8.1 C9.1 C10.1 C11.1 C12.1 C13.1 C14.1 C15.1 C16.1 C17.2 C18.2 C19.1 C20.1 C21.1 C22.1 C23.1 C24.1 C25.1 C26.1 C43.1 C44.2 C45.2 C47.1 D12.1 D14.1 D15.1 D16.1 D17.1 D18.1 D19.1 D20.1 D21.1 J6.3 J6.5 J6.9 R6.2 R11.2 U99.23(VSS) U99.35(VSSA) U99.48(VSS) U99.63(VSS) U99.74(VSS) U99.99(VSS) Y1.2(GND) Y1.4(GND)
ADC_IN_1: D14.2 R13.1
ADC_IN_1_uC: R14.2 U99.20(PA0)
ADC_IN_2: D15.2 R15.1
ADC_IN_2_uC: R16.2 U99.21(PA1)
ADC_IN_3: D16.2 R17.1
ADC_IN_3_uC: R18.2 U99.22(PA2)
ADC_IN_4: D17.2 R19.1
ADC_IN_4_uC: R20.2 U99.25(PA3)
ADC_IN_5: D18.2 R21.1
ADC_IN_5_uC: R22.2 U99.26(PA4)
ADC_IN_6: D19.2 R23.1
ADC_IN_6_uC: R24.2 U99.27(PA5)
ADC_IN_7: D20.2 R25.1
ADC_IN_7_uC: R26.2 U99.28(PA6)
ADC_IN_8: D21.2 R27.1
ADC_IN_8_uC: R28.2 U99.29(PA7)
ADC_REF_IN: D12.2 R3.1
ALIVE_LED: D13.2 U99.96(PB9)
BOOT0: R5.2 R6.1 U99.95(PB8-BOOT0)
CAN1_RX: U99.82(PD0)
CAN1_TX: U99.83(PD1)
CENTER: U99.31(PC5)
DOWN: U99.32(PB0)
I2C2_SCL_uC: U99.70(PA9)
I2C2_SDA_uC: U99.69(PA8)
I2C4_SCL_uC: U99.65(PC6)
I2C4_SDA_uC: U99.66(PC7)
IO_1_uC: U99.97(PE0)
IO_2_uC: U99.98(PE1)
IO_3_uC: U99.1(PE2)
IO_4_uC: U99.2(PE3)
IO_5_uC: U99.3(PE4)
IO_6_uC: U99.4(PE5)
IO_7_uC: U99.5(PE6)
IO_8_uC: U99.10(PF9)
IO_9_uC: U99.42(PE11)
IO_10_uC: U99.39(PE8)
IO_11_uC: U99.41(PE10)
IO_12_uC: U99.40(PE9)
IO_13_uC: U99.43(PE12)
IO_14_uC: U99.51(PB12)
LCD_BL: R11.1 U99.91(PB4)
LCD_CSn: R8.2 U99.89(PD7)
LCD_DC: R9.2 U99.88(PD6)
LCD_MOSI: U99.92(PB5)
LCD_RSTn: R10.2 U99.87(PD5)
LCD_SCLK: U99.90(PB3)
LEFT: U99.38(PE7)
NRST: C16.2 J6.10 R4.2 U99.14(PG10_~{RST})
OSC24M_IN: C44.1 U99.12(PF0-OSC_IN) Y1.3
OSC24M_OUT: C45.1 U99.13(PF1-OSC_OUT) Y1.1
OSC32_IN: C17.1 U99.8(PC14-OSC32_IN) X9.2(OSC2)
OSC32_OUT: C18.1 U99.9(PC15-OSC32_OUT) X9.1(OSC1)
QSPI_CLK: U99.11(PF10)
QSPI_CSn: U99.85(PD3)
QSPI_D0: U99.16(PC1)
QSPI_D1: U99.17(PC2)
QSPI_D2: U99.18(PC3)
QSPI_D3: U99.30(PC4)
RIGHT: U99.34(PB2)
RS485_DE: U99.67(PC8)
SPI2_MISO_uC: U99.53(PB14)
SPI2_MOSI_uC: U99.54(PB15)
SPI2_SCK_uC: U99.52(PB13)
SWDCLK: J6.4 U99.77(PA14)
SWDIO: J6.2 U99.76(PA13)
TAMPER_IO: R7.1 U99.7(PC13)
UART1_RX: U99.94(PB7)
UART1_TX: U99.93(PB6)
UART3_RX: U99.50(PB11)
UART3_TX: U99.47(PB10)
uC_VBAT: C43.2 C47.2 D25.2 D26.2 R7.2 U99.6(VBAT)
UP: U99.33(PB1)
USB_N: U99.72(PA11)
USB_P: U99.73(PA12)
VBUS_DETECT: U99.71(PA10)
NetBT1_P: BT1.P(POS) D26.1
NetC12_2: C12.2 C13.2 FB4.1 U99.37(VDDA)
NetC14_2: C14.2 C15.2 R3.2 U99.36(VREF+)
NetC19_2: C19.2 R13.2 R14.1
NetC20_2: C20.2 R15.2 R16.1
NetC21_2: C21.2 R17.2 R18.1
NetC22_2: C22.2 R19.2 R20.1
NetC23_2: C23.2 R21.2 R22.1
NetC24_2: C24.2 R23.2 R24.1
NetC25_2: C25.2 R25.2 R26.1
NetC26_2: C26.2 R27.2 R28.1
NetD13_1: D13.1 R12.1

Not connected (* = marked no-connect by the designer): J6 6* 7* 8*; U99 15(PC0) 19(PF2) 44(PE13) 45(PE14) 46(PE15) 55(PD8) 56(PD9) 57(PD10) 58(PD11) 59(PD12) 60(PD13) 61(PD14) 62(PD15) 68(PC9) 78(PA15) 79(PC10) 80(PC11) 81(PC12) 84(PD2) 86(PD4)

### Layout directives
differential pair: USB_N, USB_P

### Notes on the sheet
- Weak PU to preserve Battery
- TAMPER trigged when low
- EXT 32kHz Crystal
- (near C45) EXT 24MHz Crystal
- Proje/Project:
- Sayfa Adı/Document Name:
- Çizilme Tarihi/Drawing Date
- Umit KAYACIK
- Tasarlayan/Designed By
- Sayfa/Sheet:
- Revision:
- of
- Son Güncelleme/Last Edit Date
- Kontrol eden/Checked By
- Onaylayan/Approved By
- Boyut/Size:
- Varyant/Variant:
- Dil/Language:
- A3
- ENG

### Library data of the parts
BT1 = 1056: Battery Holder, SMT, 1 Coin Cell, 12mm, Plastic, UL94V-0 | Keystone Electronics 1056; MF: Keystone Electronics Corp.; SnapEDA_Link: https://www.snapeda.com/parts/1056/Keystone/view-part/?ref=snap; Package: None; Value: *; MP: 1056; Check_prices: https://www.snapeda.com/parts/1056/Keystone/view-part/?ref=eda
C6 = C1005X7S1A105K050BC: as C1 on sheet 03_CONNECTOR; Part Number: C1005X7S1A105K050BC; Value: 1 µF; Applications: General Purpose; Capacitance: 1 µF; componentlink1description: Datasheet; componentlink1url: https://product.tdk.com/info/en/catalog/datasheets/mlcc_commercial_general_en.pdf?ref_disty=digikey; componentlink2description: DigiKey Link; componentlink2url: https://www.digikey.com/en/products/detail/tdk-corporation/C1005X7S1A105K050BC/3661576; Device Package: 0402 (1005 Metric); Features: Low ESL; lastupdated: 2/9/2024 8:04:17 PM; Lifecycle Status: Active; Minimum Order: 1; Mounting Type: Surface Mount, MLCC; Operating Temperature: -55°C ~ 125°C; Package / Case: 0402 (1005 Metric); packaging: TapeAndReel; partid: 34315; Part Status: Active; price: 0.03; series: C; Size / Dimension: 0.039" L x 0.020" W (1.00mm x 0.50mm); Supplier 1: DigiKey; Supplier Part Number 1: 445-9116-1-ND; Temperature Coefficient: X7S; Thickness (Max): 0.022" (0.55mm)
C7-C10 C12 C14 C16 C43 C47 = GRM155R71H104KE14J: as C3 on sheet 03_CONNECTOR; Part Number: GRM155R71H104KE14J; Capacitance: 0.1 µF; Applications: General Purpose; componentlink1description: Datasheet; componentlink1url: https://search.murata.co.jp/Ceramy/image/img/A01X/G101/ENG/GRM155R71H104KE14-01.pdf; componentlink2description: DigiKey Link; componentlink2url: https://www.digikey.com/en/products/detail/murata-electronics/GRM155R71H104KE14J/4905180; Device Package: 0402 (1005 Metric); lastupdated: 7/23/2025 10:42:35 AM; Lifecycle Status: Active; Minimum Order: 1; Mounting Type: Surface Mount, MLCC; Operating Temperature: -55°C ~ 125°C; Package / Case: 0402 (1005 Metric); packaging: CutTape; partid: 4071; Part Status: Active; price: 0.01; series: GRM; Size / Dimension: 0.039" L x 0.020" W (1.00mm x 0.50mm); Supplier 1: DigiKey; Supplier Part Number 1: 490-13342-1-ND; Temperature Coefficient: X7R; Thickness (Max): 0.022" (0.55mm); value: 0.1 µF; Voltage - Rated: 50V
C11 C13 C15 = CC0402KRX7R9BB103: as C4 on sheet 03_CONNECTOR; Part Number: CC0402KRX7R9BB103; Value: 10000 pF; Applications: General Purpose; Capacitance: 10000 pF; componentlink1description: Datasheet; componentlink1url: https://www.yageo.com/upload/media/product/productsearch/datasheet/mlcc/UPY-GPHC_X7R_6.3V-to-50V_18.pdf; componentlink2description: DigiKey Link; componentlink2url: https://www.digikey.com/en/products/detail/yageo/CC0402KRX7R9BB103/2103087; Device Package: 0402 (1005 Metric); lastupdated: 2/9/2024 8:04:30 PM; Lifecycle Status: Active; Minimum Order: 10; Mounting Type: Surface Mount, MLCC; Operating Temperature: -55°C ~ 125°C; Package / Case: 0402 (1005 Metric); packaging: CutTape; partid: 6681; Part Status: Active; price: 0.01; series: CC; Size / Dimension: 0.039" L x 0.020" W (1.00mm x 0.50mm); Supplier 1: DigiKey; Supplier Part Number 1: 311-1349-1-ND; Temperature Coefficient: X7R; Thickness (Max): 0.022" (0.55mm)
C17 C18 C44 C45 = CC0402GRNPO9BN150: CAP CER 15PF 50V C0G/NPO 0402; manufacturer: Yageo; Temperature Coefficient: C0G, NP0; Tolerance: ±2%; Part Number: CC0402GRNPO9BN150; Value: 15 pF; Applications: General Purpose; Capacitance: 15 pF; componentlink1description: Datasheet; componentlink1url: https://www.yageo.com/upload/media/product/productsearch/datasheet/mlcc/UPY-GP_NP0_16V-to-50V_17.pdf; componentlink2description: DigiKey Link; componentlink2url: https://www.digikey.com/en/products/detail/yageo/CC0402GRNPO9BN150/5195058; Device Package: 0402 (1005 Metric); lastupdated: 2/9/2024 8:04:37 PM; Lifecycle Status: Active; Minimum Order: 10; Mounting Type: Surface Mount, MLCC; Operating Temperature: -55°C ~ 125°C; Package / Case: 0402 (1005 Metric); packaging: TapeAndReel; partid: 1901; Part Status: Active; price: 0.01; series: CC; Size / Dimension: 0.039" L x 0.020" W (1.00mm x 0.50mm); Supplier 1: DigiKey; Supplier Part Number 1: 311-1649-1-ND; Thickness (Max): 0.022" (0.55mm); Voltage - Rated: 50V
C19-C26 = CC0402KRX7R9BB102: as C5 on sheet 03_CONNECTOR; Part Number: CC0402KRX7R9BB102; Value: 1000 pF; Applications: General Purpose; Capacitance: 1000 pF; componentlink1description: Datasheet; componentlink1url: https://www.yageo.com/upload/media/product/productsearch/datasheet/mlcc/UPY-GPHC_X7R_6.3V-to-50V_18.pdf; componentlink2description: DigiKey Link; componentlink2url: https://www.digikey.com/en/products/detail/yageo/CC0402KRX7R9BB102/302770; Device Package: 0402 (1005 Metric); lastupdated: 2/9/2024 8:04:33 PM; Lifecycle Status: Active; Minimum Order: 10; Mounting Type: Surface Mount, MLCC; Operating Temperature: -55°C ~ 125°C; Package / Case: 0402 (1005 Metric); packaging: CutTape; partid: 4791; Part Status: Active; price: 0.01; series: CC; Size / Dimension: 0.039" L x 0.020" W (1.00mm x 0.50mm); Supplier 1: DigiKey; Supplier Part Number 1: 311-1036-1-ND; Temperature Coefficient: X7R; Thickness (Max): 0.022" (0.55mm); Voltage - Rated: 50V
D12 D14-D21 = CMP-08607-000062-1: as D1 on sheet 03_CONNECTOR; Octopart: https://octopart.com/rf2945-000-littelfuse-56516902; Device Class L3: unset; ComponentLink2Description: Datasheet; Lead Free: Yes; Temperature Range Low: -55°C; Clamping Voltage: 10V; Digikey Description: TVS DIODE 7V 10V 0402; Category: Diode; Temperature: -55°C to +125°C; Device Class L1: Circuit Protection; Capacitance: 0.1pF; RoHS: TRUE; Device Class L2: TVS Diodes; Package: SESD0402; Reverse Standoff Voltage: 7V; Automotive: Yes; Height: 0.43mm; Manufacturer Part Number: RF2945-000; Temperature Range High: +125°C; ComponentLink2URL: https://www.littelfuse.com/~/media/electronics/datasheets/tvs_diode_arrays/littelfuse_tvs_diode_array_sesd_ultra_low_capacitance_discrete_tvs_datasheet.pdf.pdf
D13 = TLMP1100-GS08: LED GREEN 0603 SMD; Manufacturer: Vishay Semiconductor Opto Division; Configuration: Standard; Current - Test: 20mA; Lens Color: 0.65mm; Lens Size: 1.60mm x 0.80mm; Lens Style: Rectangle with Flat Top; Millicandela Rating: 15mcd; Viewing Angle: 160°; Voltage - Forward (Vf) (Typ): 2.1V; Wavelength - Dominant: 561nm; Wavelength - Peak: 562nm; Part Number: TLMP1100-GS08; Color: Green; ComponentLink1Description: Datasheet; ComponentLink1URL: http://www.vishay.com/docs/83173/tlmb1100.pdf; ComponentLink2Description: DigiKey Link; ComponentLink2URL: https://www.digikey.com/en/products/detail/vishay-semiconductor-opto-division/TLMP1100-GS08/1681311; Device Package: 0603 (1608 Metric); Height (Max): 0.65mm; LastUpdated: 3/11/2024 7:51:09 AM; Lifecycle Status: Active; Minimum Order: 1; Mounting Type: Surface Mount; Package / Case: 0603 (1608 Metric); Packaging: TapeAndReel; PartId: 692; Part Status: Active; Price: 0.11; Series: Automotive, AEC-Q101; Size / Dimension: 1.60mm L x 0.80mm W; Supplier 1: DigiKey; Supplier Part Number 1: 751-1176-1-ND; Supplier Device Package: 0603; Value: Green
D25 D26 = MBR0520LT1G: DIODE SCHOTTKY 20V 500MA SOD123; Manufacturer: ON Semiconductor; Current - Reverse Leakage @ Vr: 250µA @ 20V; Speed: Fast Recovery =< 500ns, > 200mA (Io); Voltage - Forward (Vf) (Max) @ If: 385mV @ 500mA; Part Number: MBR0520LT1G; ComponentLink1Description: Datasheet; ComponentLink1URL: http://www.onsemi.com/pub/Collateral/MBR0520LT1-D.PDF; ComponentLink2Description: DigiKey Link; ComponentLink2URL: http://digikey.com/product-detail/en/on-semiconductor/MBR0520LT1G/MBR0520LT1GOSCT-ND/917965; Current - Average Rectified (Io): 500mA; Diode Type: Schottky; LastUpdated: 6/3/2024 7:54:46 PM; Lifecycle Status: Active; Minimum Order: 1; Mounting Type: Surface Mount; Operating Temperature - Junction: -65°C ~ 125°C; Package / Case: SOD-123; Packaging: TapeAndReel; PartId: 2222; Part Status: Active; Price: 0.05; Series: -; Supplier 1: DigiKey; Supplier Part Number 1: MBR0520LT1GOSCT-ND; Supplier Device Package: SOD-123; Voltage - DC Reverse (Vr) (Max): 20V
FB4 = MH1608-101Y: FERRITE BEAD 100 OHM 0603 1LN; Manufacturer: Bourns Inc.; Current Rating (Max): 3A; DC Resistance (DCR) (Max): 40mOhm; Filter Type: Power, Signal Line; Number of Lines: 1; Part Number: MH1608-101Y; ComponentLink1Description: Datasheet; ComponentLink1URL: https://www.bourns.com/docs/Product-Datasheets/mh.pdf; ComponentLink2Description: DigiKey Link; ComponentLink2URL: https://www.digikey.com/en/products/detail/bourns-inc/MH1608-101Y/2563310; Device Package: 0603 (1608 Metric); Height (Max): 0.039" (1.00mm); Impedance @ Frequency: 100 Ohms @ 100 MHz; LastUpdated: 5/9/2023 8:13:07 PM; Lifecycle Status: Active; Minimum Order: 1; Mounting Type: Surface Mount; Operating Temperature: -55°C ~ 125°C; Package / Case: 0603 (1608 Metric); Packaging: TapeAndReel; PartId: 645; Part Status: Active; Price: 0.02; Series: MH; Size / Dimension: 0.063" L x 0.032" W (1.60mm x 0.80mm); Supplier 1: DigiKey; Supplier Part Number 1: MH1608-101YCT-ND; Value: 100 Ohms @ 100 MHz
J6 = FTSH-105-01-F-DV-K-P-TR: Connector Header Surface Mount 10 position 0.050" (1.27mm); Manufacturer Name: Samtec Inc.; Pitch - Mating: 0.050(1.27mm); Number of Positions: 10; Manufacturer Part Number: FTSH-105-01-F-DV-K-P-TR; Number of Rows: 2
R3 = RC0805FR-07120RL: as R1 on sheet 03_CONNECTOR; Part Number: RC0805FR-07120RL; Value: 120 Ohms; ComponentLink1Description: Datasheet; ComponentLink1URL: https://www.yageo.com/upload/media/product/productsearch/datasheet/rchip/PYu-RC_Group_51_RoHS_L_10.pdf; ComponentLink2Description: DigiKey Link; ComponentLink2URL: https://www.digikey.com/en/products/detail/yageo/RC0805FR-07120RL/727575; Composition: Thick Film; Device Package: 0805 (2012 Metric); Features: Moisture Resistant; Height - Seated (Max): 0.024" (0.60mm); LastUpdated: 7/25/2024 9:20:22 AM; Lifecycle Status: Active; Minimum Order: 1; Number of Terminations: 2; Operating Temperature: -55°C ~ 155°C; Package / Case: 0805 (2012 Metric); Packaging: TapeAndReel; PartId: 39440; Part Status: Active; Price: 0.01; Resistance: 120 Ohms; Series: RC_L; Size / Dimension: 0.079" L x 0.049" W (2.00mm x 1.25mm); Supplier 1: DigiKey; Supplier Part Number 1: 311-120CRCT-ND; Supplier Device Package: 0805; Tolerance: ±1%
R4-R6 R8-R11 = RC0402FR-0710KL: as R35 on sheet 03_CONNECTOR; Part Number: RC0402FR-0710KL; Value: 10 kOhms; ComponentLink1Description: Datasheet; ComponentLink1URL: https://www.yageo.com/upload/media/product/productsearch/datasheet/rchip/PYu-RC_Group_51_RoHS_L_10.pdf; ComponentLink2Description: DigiKey Link; ComponentLink2URL: https://www.digikey.com/en/products/detail/yageo/RC0402FR-0710KL/726523; Composition: Thick Film; Device Package: 0402 (1005 Metric); Features: Moisture Resistant; Height - Seated (Max): 0.016" (0.40mm); LastUpdated: 30.04.2023 19:24:29; Lifecycle Status: Active; Minimum Order: 1; Number of Terminations: 2; Operating Temperature: -55°C ~ 155°C; Package / Case: 0402 (1005 Metric); Packaging: CutTape; PartId: 17593; Part Status: Active; Price: 0.01; Resistance: 10 kOhms; Series: RC_L; Size / Dimension: 0.039" L x 0.020" W (1.00mm x 0.50mm); Supplier 1: DigiKey; Supplier Part Number 1: 311-10.0KLRCT-ND; Supplier Device Package: 0402; Tolerance: ±1%
R7 = RC0402FR-07470KL: RES 470K OHM 1% 1/16W 0402; Manufacturer: Yageo; Power (Watts): 0.063W, 1/16W; Temperature Coefficient: ±100ppm/°C; Part Number: RC0402FR-07470KL; Value: 470 kOhms; ComponentLink1Description: Datasheet; ComponentLink1URL: https://www.yageo.com/upload/media/product/productsearch/datasheet/rchip/PYu-RC_Group_51_RoHS_L_10.pdf; ComponentLink2Description: DigiKey Link; ComponentLink2URL: https://www.digikey.com/en/products/detail/yageo/RC0402FR-07470KL/726618; Composition: Thick Film; Device Package: 0402 (1005 Metric); Features: Moisture Resistant; Height - Seated (Max): 0.016" (0.40mm); LastUpdated: 8/31/2025 3:04:04 PM; Lifecycle Status: Active; Minimum Order: 1; Number of Terminations: 2; Operating Temperature: -55°C ~ 155°C; Package / Case: 0402 (1005 Metric); Packaging: CutTape; PartId: 17965; Part Status: Active; Price: 0.01; Resistance: 470 kOhms; Series: RC_L; Size / Dimension: 0.039" L x 0.020" W (1.00mm x 0.50mm); Supplier 1: DigiKey; Supplier Part Number 1: 311-470KLRCT-ND; Supplier Device Package: 0402; Tolerance: ±1%
R12 = RMCF0402FT2K20: RES 2.2K OHM 1% 1/16W 0402; Manufacturer: Stackpole Electronics Inc; Power (Watts): 0.063W, 1/16W; Temperature Coefficient: ±100ppm/°C; Part Number: RMCF0402FT2K20; Value: 2.2 kOhms; ComponentLink1Description: Datasheet; ComponentLink1URL: https://www.seielect.com/catalog/sei-rmcf_rmcp.pdf; ComponentLink2Description: DigiKey Link; ComponentLink2URL: https://www.digikey.com/en/products/detail/stackpole-electronics-inc/RMCF0402FT2K20/2417439; Composition: Thick Film; Device Package: 0402 (1005 Metric); Features: Automotive AEC-Q200; Height - Seated (Max): 0.016" (0.40mm); LastUpdated: 2/9/2024 8:30:13 PM; Lifecycle Status: Active; Minimum Order: 1; Number of Terminations: 2; Operating Temperature: -55°C ~ 155°C; Package / Case: 0402 (1005 Metric); Packaging: CutTape; PartId: 4919; Part Status: Active; Price: 0.01; Ratings: AEC-Q200; Resistance: 2.2 kOhms; Series: RMCF; Size / Dimension: 0.039" L x 0.020" W (1.00mm x 0.50mm); Supplier 1: DigiKey; Supplier Part Number 1: RMCF0402FT2K20CT-ND; Supplier Device Package: 0402; Tolerance: ±1%
R13-R28 = RC0402FR-0733RL: RES 33 OHM 1% 1/16W 0402; Manufacturer: Yageo; Power (Watts): 0.063W, 1/16W; Temperature Coefficient: ±100ppm/°C; Part Number: RC0402FR-0733RL; Value: 33 Ohms; ComponentLink1Description: Datasheet; ComponentLink1URL: https://www.yageo.com/upload/media/product/productsearch/datasheet/rchip/PYu-RC_Group_51_RoHS_L_10.pdf; ComponentLink2Description: DigiKey Link; ComponentLink2URL: https://www.digikey.com/en/products/detail/yageo/RC0402FR-0733RL/726593; Composition: Thick Film; Device Package: 0402 (1005 Metric); Features: Moisture Resistant; Height - Seated (Max): 0.016" (0.40mm); LastUpdated: 8/31/2025 3:03:59 PM; Lifecycle Status: Active; Minimum Order: 1; Number of Terminations: 2; Operating Temperature: -55°C ~ 155°C; Package / Case: 0402 (1005 Metric); Packaging: CutTape; PartId: 20555; Part Status: Active; Price: 0.01; Resistance: 33 Ohms; Series: RC_L; Size / Dimension: 0.039" L x 0.020" W (1.00mm x 0.50mm); Supplier 1: DigiKey; Supplier Part Number 1: 311-33.0LRCT-ND; Supplier Device Package: 0402; Tolerance: ±1%
U99 = CMP-12105-000116-1: IC MCU 32BIT 512KB FLASH 100LQFP; RoHS Compliant: Yes
X9 = CRY_32.768KHZ: 32.768 kHz ±20ppm Crystal 12.5pF 70 kOhms 2-SMD, No Lead; Manufacturer Part Number: CM7V-T1A-32.768KHZ-12.5PF-20PPM-TB-QA; Order Code: DIGI : 2195-CM7V-T1A-32.768KHZ-12.5PF-20PPM-TB-QACT-ND
Y1 = TSX-3225 24.0000MF20G-AC3: CRYSTAL 24.0000MHZ 9PF SMD; Manufacturer: EPSON; ESR (Equivalent Series Resistance): 40 Ohms; Frequency Stability: ±20ppm; Frequency Tolerance: ±10ppm; Operating Mode: Fundamental; Part Number: TSX-3225 24.0000MF20G-AC3; ComponentLink1Description: Datasheet; ComponentLink1URL: https://support.epson.biz/td/api/doc_check.php?dl=brief_TSX-3225&lang=en; ComponentLink2Description: DigiKey Link; ComponentLink2URL: https://www.digikey.com/en/products/detail/epson/TSX-3225-24-0000MF20G-AC3/1825443; Frequency: 24 MHz; Height - Seated (Max): 0.024" (0.60mm); LastUpdated: 6/3/2024 8:02:15 PM; Lifecycle Status: Active; Load Capacitance: 9pF; Minimum Order: 1; Mounting Type: Surface Mount; Operating Temperature: -40°C ~ 105°C; Package / Case: 4-SMD, No Lead; Packaging: TapeAndReel; PartId: 440; Part Status: Active; Price: 0.40; Series: TSX-3225; Size / Dimension: 0.126" L x 0.098" W (3.20mm x 2.50mm); Supplier 1: DigiKey; Supplier Part Number 1: SER3634CT-ND; Type: MHz Crystal; Value: 24 MHz